# Altium schematic sheet 5_Airframe-NXP_i.MX7_Power.SchDoc
size A2; SheetNumber: 5; SheetTotal: 9
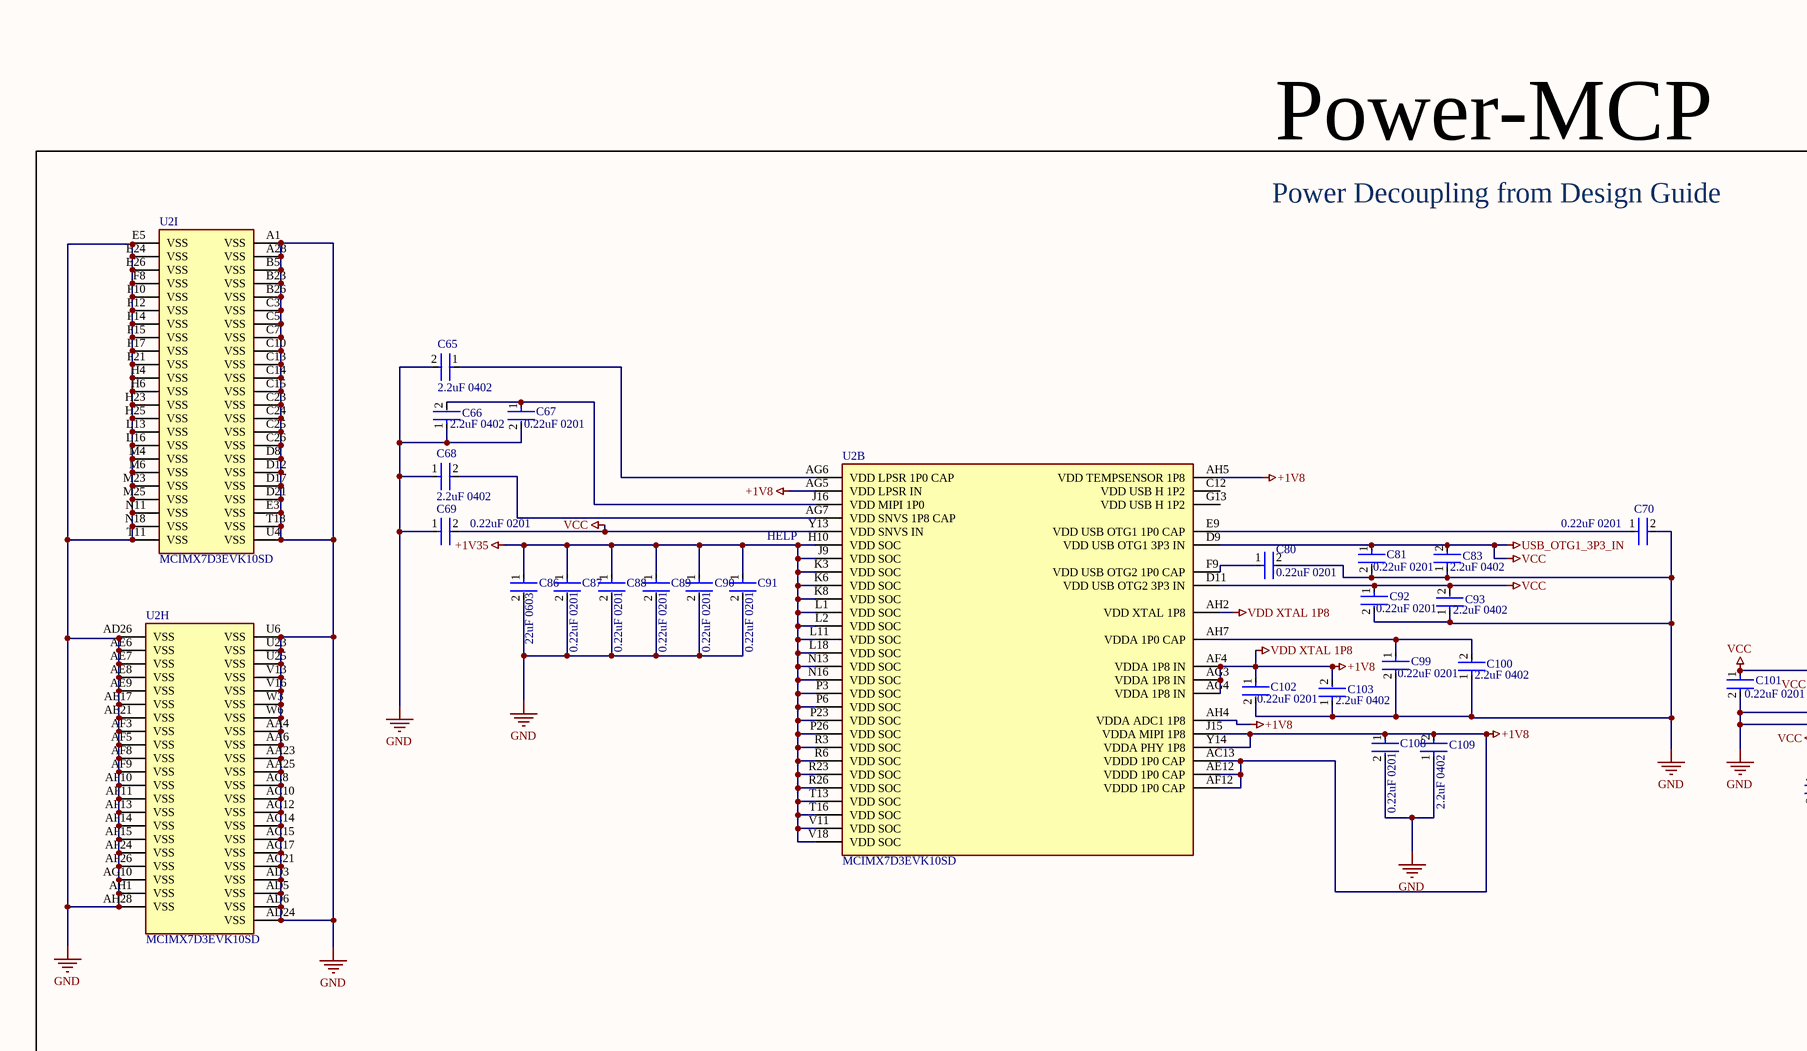
[diagram p0: 5_Airframe-NXP_i.MX7_Power.SchDoc, left]
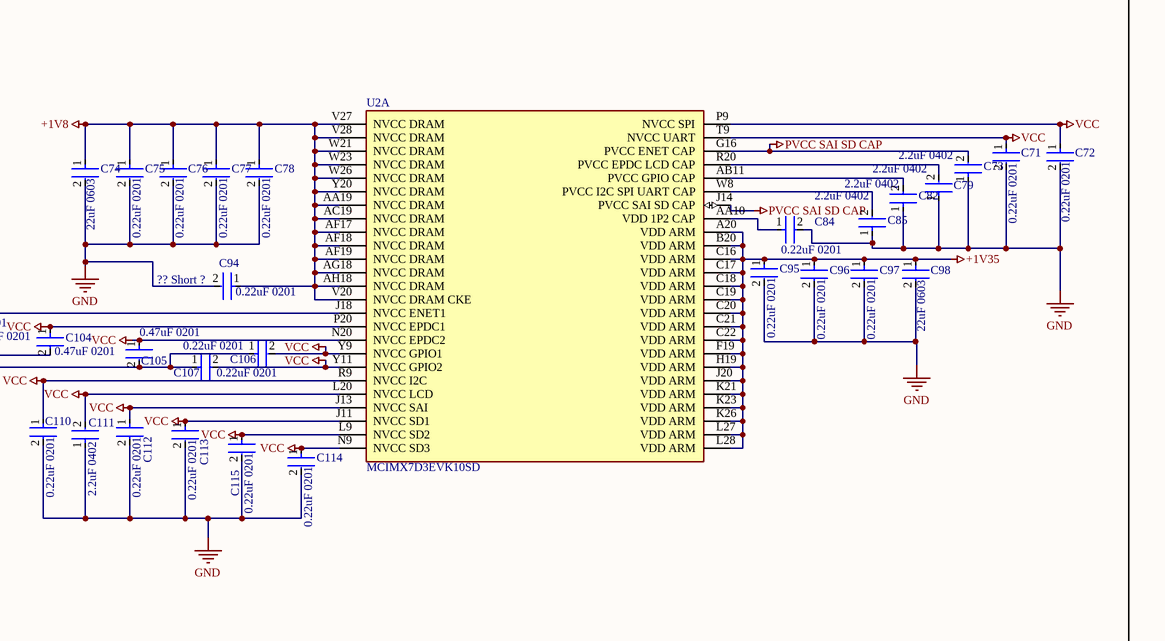
[diagram p1: 5_Airframe-NXP_i.MX7_Power.SchDoc, right]

## Parts
C65  2.2uF 0402  [FP-C0402C225M9PACTU-MFG]
C66  2.2uF 0402  [FP-C0402C225M9PACTU-MFG]
C67  0.22uF 0201  [FP-C0603-030-0_03-IPC_C]
C68  2.2uF 0402  [FP-C0402C225M9PACTU-MFG]
C69  0.22uF 0201  [FP-C0603-030-0_03-IPC_C]
C70  0.22uF 0201  [FP-C0603-030-0_03-IPC_C]
C71  0.22uF 0201  [FP-C0603-030-0_03-IPC_C]
C72  0.22uF 0201  [FP-C0603-030-0_03-IPC_C]
C73  2.2uF 0402  [FP-C0402C225M9PACTU-MFG]
C74  22uF 0603  [FP-GRM188-0_2-IPC_C]
C75  0.22uF 0201  [FP-C0603-030-0_03-IPC_C]
C76  0.22uF 0201  [FP-C0603-030-0_03-IPC_C]
C77  0.22uF 0201  [FP-C0603-030-0_03-IPC_C]
C78  0.22uF 0201  [FP-C0603-030-0_03-IPC_C]
C79  2.2uF 0402  [FP-C0402C225M9PACTU-MFG]
C80  0.22uF 0201  [FP-C0603-030-0_03-IPC_C]
C81  0.22uF 0201  [FP-C0603-030-0_03-IPC_C]
C82  2.2uF 0402  [FP-C0402C225M9PACTU-MFG]
C83  2.2uF 0402  [FP-C0402C225M9PACTU-MFG]
C84  0.22uF 0201  [FP-C0603-030-0_03-IPC_C]
C85  2.2uF 0402  [FP-C0402C225M9PACTU-MFG]
C86  22uF 0603  [FP-GRM188-0_2-IPC_C]
C87  0.22uF 0201  [FP-C0603-030-0_03-IPC_C]
C88  0.22uF 0201  [FP-C0603-030-0_03-IPC_C]
C89  0.22uF 0201  [FP-C0603-030-0_03-IPC_C]
C90  0.22uF 0201  [FP-C0603-030-0_03-IPC_C]
C91  0.22uF 0201  [FP-C0603-030-0_03-IPC_C]
C92  0.22uF 0201  [FP-C0603-030-0_03-IPC_C]
C93  2.2uF 0402  [FP-C0402C225M9PACTU-MFG]
C94  0.22uF 0201  [FP-C0603-030-0_03-IPC_C]
C95  0.22uF 0201  [FP-C0603-030-0_03-IPC_C]
C96  0.22uF 0201  [FP-C0603-030-0_03-IPC_C]
C97  0.22uF 0201  [FP-C0603-030-0_03-IPC_C]
C98  22uF 0603  [FP-GRM188-0_2-IPC_C]
C99  0.22uF 0201  [FP-C0603-030-0_03-IPC_C]
C100  2.2uF 0402  [FP-C0402C225M9PACTU-MFG]
C101  0.22uF 0201  [FP-C0603-030-0_03-IPC_C]
C102  0.22uF 0201  [FP-C0603-030-0_03-IPC_C]
C103  2.2uF 0402  [FP-C0402C225M9PACTU-MFG]
C104  0.47uF 0201  [FP-C0603-030-0_03-IPC_C]
C105  0.47uF 0201  [FP-C0603-030-0_03-IPC_C]
C106  0.22uF 0201  [FP-C0603-030-0_03-IPC_C]
C107  0.22uF 0201  [FP-C0603-030-0_03-IPC_C]
C108  0.22uF 0201  [FP-C0603-030-0_03-IPC_C]
C109  2.2uF 0402  [FP-C0402C225M9PACTU-MFG]
C110  0.22uF 0201  [FP-C0603-030-0_03-IPC_C]
C111  2.2uF 0402  [FP-C0402C225M9PACTU-MFG]
C112  0.22uF 0201  [FP-C0603-030-0_03-IPC_C]
C113  0.22uF 0201  [FP-C0603-030-0_03-IPC_C]
C114  0.22uF 0201  [FP-C0603-030-0_03-IPC_C]
C115  0.22uF 0201  [FP-C0603-030-0_03-IPC_C]
U2  MCIMX7D3EVK10SD  [FP-SOT1839-1-IPC_C]  (parts A,B,H,I of 9)

## Nets
+1V8: C74.1 C75.1 C76.1 C77.1 C78.1 C94.1 C102.1 C103.2 C108.1 C109.2 U2.AA19(NVCC_DRAM) U2.AC13(VDDD_1P0_CAP) U2.AC19(NVCC_DRAM) U2.AE12(VDDD_1P0_CAP) U2.AF4(VDDA_1P8_IN) U2.AF12(VDDD_1P0_CAP) U2.AF17(NVCC_DRAM) U2.AF18(NVCC_DRAM) U2.AF19(NVCC_DRAM) U2.AG3(VDDA_1P8_IN) U2.AG4(VDDA_1P8_IN) U2.AG5(VDD_LPSR_IN) U2.AG18(NVCC_DRAM) U2.AH2(VDD_XTAL_1P8) U2.AH4(VDDA_ADC1_1P8) U2.AH5(VDD_TEMPSENSOR_1P8) U2.AH18(NVCC_DRAM) U2.J15(VDDA_MIPI_1P8) U2.V20(NVCC_DRAM_CKE) U2.V27(NVCC_DRAM) U2.V28(NVCC_DRAM) U2.W21(NVCC_DRAM) U2.W23(NVCC_DRAM) U2.W26(NVCC_DRAM) U2.Y14(VDDA_PHY_1P8) U2.Y20(NVCC_DRAM)  [also labelled VDD XTAL 1P8]
+1V35: C86.1 C87.1 C88.1 C89.1 C90.1 C91.1 C95.1 C96.1 C97.1 C98.1 U2.A20(VDD_ARM) U2.B20(VDD_ARM) U2.C16(VDD_ARM) U2.C17(VDD_ARM) U2.C18(VDD_ARM) U2.C19(VDD_ARM) U2.C20(VDD_ARM) U2.C21(VDD_ARM) U2.C22(VDD_ARM) U2.F19(VDD_ARM) U2.H10(VDD_SOC) U2.H19(VDD_ARM) U2.J9(VDD_SOC) U2.J20(VDD_ARM) U2.K3(VDD_SOC) U2.K6(VDD_SOC) U2.K8(VDD_SOC) U2.K21(VDD_ARM) U2.K23(VDD_ARM) U2.K26(VDD_ARM) U2.L1(VDD_SOC) U2.L2(VDD_SOC) U2.L11(VDD_SOC) U2.L18(VDD_SOC) U2.L27(VDD_ARM) U2.L28(VDD_ARM) U2.N13(VDD_SOC) U2.N16(VDD_SOC) U2.P3(VDD_SOC) U2.P6(VDD_SOC) U2.P23(VDD_SOC) U2.P26(VDD_SOC) U2.R3(VDD_SOC) U2.R6(VDD_SOC) U2.R23(VDD_SOC) U2.R26(VDD_SOC) U2.T13(VDD_SOC) U2.T16(VDD_SOC) U2.V11(VDD_SOC) U2.V18(VDD_SOC)
GND: C65.2 C66.1 C67.2 C68.1 C69.1 C70.2 C71.2 C72.2 C73.1 C74.2 C75.2 C76.2 C77.2 C78.2 C79.1 C80.2 C81.2 C82.1 C83.1 C84.2 C85.1 C86.2 C87.2 C88.2 C89.2 C90.2 C91.2 C92.2 C93.1 C94.2 C95.2 C96.2 C97.2 C98.2 C99.2 C100.1 C101.2 C102.2 C103.1 C104.2 C105.2 C106.1 C107.1 C108.2 C109.1 C110.2 C111.1 C112.2 C113.2 C114.2 C115.2 U2.A1(VSS) U2.A28(VSS) U2.AA4(VSS) U2.AA6(VSS) U2.AA23(VSS) U2.AA25(VSS) U2.AC8(VSS) U2.AC10(VSS) U2.AC12(VSS) U2.AC14(VSS) U2.AC15(VSS) U2.AC17(VSS) U2.AC21(VSS) U2.AD3(VSS) U2.AD5(VSS) U2.AD6(VSS) U2.AD24(VSS) U2.AD26(VSS) U2.AE6(VSS) U2.AE7(VSS) U2.AE8(VSS) U2.AE9(VSS) U2.AE17(VSS) U2.AE21(VSS) U2.AF3(VSS) U2.AF5(VSS) U2.AF8(VSS) U2.AF9(VSS) U2.AF10(VSS) U2.AF11(VSS) U2.AF13(VSS) U2.AF14(VSS) U2.AF15(VSS) U2.AF24(VSS) U2.AF26(VSS) U2.AG10(VSS) U2.AH1(VSS) U2.AH28(VSS) U2.B5(VSS) U2.B23(VSS) U2.B26(VSS) U2.C3(VSS) U2.C5(VSS) U2.C7(VSS) U2.C10(VSS) U2.C13(VSS) U2.C14(VSS) U2.C15(VSS) U2.C23(VSS) U2.C24(VSS) U2.C25(VSS) U2.C26(VSS) U2.D8(VSS) U2.D12(VSS) U2.D17(VSS) U2.D21(VSS) U2.E3(VSS) U2.E5(VSS) U2.E24(VSS) U2.E26(VSS) U2.F8(VSS) U2.F10(VSS) U2.F12(VSS) U2.F14(VSS) U2.F15(VSS) U2.F17(VSS) U2.F21(VSS) U2.H4(VSS) U2.H6(VSS) U2.H23(VSS) U2.H25(VSS) U2.L13(VSS) U2.L16(VSS) U2.M4(VSS) U2.M6(VSS) U2.M23(VSS) U2.M25(VSS) U2.N11(VSS) U2.N18(VSS) U2.T11(VSS) U2.T18(VSS) U2.U4(VSS) U2.U6(VSS) U2.U23(VSS) U2.U25(VSS) U2.V13(VSS) U2.V16(VSS) U2.W3(VSS) U2.W6(VSS)
PVCC SAI SD CAP: C73.2 U2.G16(PVCC_ENET_CAP) U2.J14(PVCC_SAI_SD_CAP)
USB_OTG1_3P3_IN: C69.2 C71.1 C72.1 C81.1 C83.2 C92.1 C93.2 C101.1 C104.1 C105.1 C106.2 C107.2 C110.1 C111.2 C112.1 C113.1 C114.1 C115.1 U2.D9(VDD_USB_OTG1_3P3_IN) U2.D11(VDD_USB_OTG2_3P3_IN) U2.J11(NVCC_SD1) U2.J13(NVCC_SAI) U2.J18(NVCC_ENET1) U2.L9(NVCC_SD2) U2.L20(NVCC_LCD) U2.N9(NVCC_SD3) U2.N20(NVCC_EPDC2) U2.P9(NVCC_SPI) U2.P20(NVCC_EPDC1) U2.R9(NVCC_I2C) U2.T9(NVCC_UART) U2.Y9(NVCC_GPIO1) U2.Y11(NVCC_GPIO2) U2.Y13(VDD_SNVS_IN)  [also labelled VCC]
NetC65_1: C65.1 U2.AG6(VDD_LPSR_1P0_CAP)
NetC66_2: C66.2 C67.1 U2.J16(VDD_MIPI_1P0)
NetC68_2: C68.2 U2.AG7(VDD_SNVS_1P8_CAP)
NetC70_1: C70.1 U2.E9(VDD_USB_OTG1_1P0_CAP)
NetC79_2: C79.2 U2.R20(PVCC_EPDC_LCD_CAP)
NetC80_1: C80.1 U2.F9(VDD_USB_OTG2_1P0_CAP)
NetC82_2: C82.2 U2.AB11(PVCC_GPIO_CAP)
NetC84_1: C84.1 U2.AA10(VDD_1P2_CAP)
NetC85_2: C85.2 U2.W8(PVCC_I2C_SPI_UART_CAP)
NetC99_1: C99.1 C100.2 U2.AH7(VDDA_1P0_CAP)

Not connected (* = marked no-connect by the designer): U2 C12(VDD_USB_H_1P2) G13(VDD_USB_H_1P2)

## Notes on the sheet
- Power-MCP
- Power Decoupling from Design Guide
- HELP
- (near C94) ?? Short ?

## Library data of the parts
C65 C66 C68 C73 C79 C82 C83 C85 C93 C100 C103 C109 C111 = CMP-2008-02064-3: CAP CER 2.2UF 6.3V X5R 0402; Tolerance: 20%; Dissipation Factor: 5%; Dielectric Material: Ceramic; Lead Free: Lead Free; Depth: 0.5mm; Series: C; Termination: SMD/SMT; Case Code (Metric): 1005; Case/Package: 0402; Dielectric: X5R; RoHS Compliant: Yes; Thickness: 0.022inch; Voltage Rating: 6.3V; Voltage: 6.3V; Height: 0.5mm; Mount: Surface Mount; Construction: Flat; Case Code (Imperial): 0402; Min Operating Temperature: -55°C; Contact Plating: Tin; Radiation Hardening: No; Number of Pins: 2; Voltage Rating (DC): 6.3V; Capacitance: 2.2uF; Width: 0.5mm; Package Quantity: 1; Packaging: Tape and Reel; Max Operating Temperature: 85°C; Length: 1mm; REACH SVHC: No SVHC
C67 C69-C72 C75-C78 C80 C81 C84 C87-C92 C94-C97 C99 C101 C102 C104-C108 C110 C112-C115 = CMP-08246-007095-1: Multilayer Ceramic Capacitors 220nF ±10% 6.3V X6S SMD 0201; Dielectric: X6S; Resistor Type: Ceramic; Length: 0.6mm; Capacitance: 220nF; Case Code (Metric): 0603; Series: C; Width: 0.012inch; Height: 0.3mm; Voltage Rating: 6.3V; Max Operating Temperature: 105°C; REACH SVHC: No SVHC; RoHS Compliant: Yes; Tolerance: 10%; Termination: SMD/SMT; Case/Package: 0201; Case Code (Imperial): 0201; Weight: 6E-06oz; Lead Free: Lead Free; Construction: Flat; Thickness: 300um; Mount: Surface Mount; Dielectric Material: Ceramic; Voltage Rating (DC): 6.3V; Packaging: Cut Tape; Package Quantity: 1; Min Operating Temperature: -55°C; Depth: 0.3mm
C74 C86 C98 = CMP-2000-06337-3: Chip Multilayer Ceramic Capacitors for General Purpose, 0603, 22uF, X5R, 15%, 20%, 10V; Tolerance: 20%; Weight: 0.000222oz; Material: Ceramic; Depth: 0.8mm; Length: 1.6mm; Termination: SMD/SMT; Capacitance: 22uF; Packaging: Tape and Reel; Width: 0.8mm; Voltage Rating: 10V; Case Code (Imperial): 0603; Mount: Surface Mount; Voltage Rating (DC): 10V; Case/Package: 0603; Thickness: 0.039inch; REACH SVHC: No SVHC; Dielectric: X5R; Height: 0.8mm; Package Quantity: 4000; Case Code (Metric): 1608; Min Operating Temperature: -55°C; Lead Free: Lead Free; Max Operating Temperature: 85°C
U2 = CMP-10096-000008-1: I.MX 7DUAL: REV 1.3; Manufacturer: NXP; Number Of I2C Channels: 4; Number Of Timers/Counters: 11; Nominal Supply Current: 1-1000mA; Max Junction Temp: +105°C; Number Of Uart Channels: 7; Number Of Cores: 2; Interface: I2C,SPI,UART,USB,Ethernet,I2S,LVDS,PCIe,Other; Ram Size: 256KBytes; Data Bus Width: 32bits; Number Of Usb Channels: 3; Number Of Adc Channels: 1; Standoff Height: 0.13mm; Frequency: 1GHz; Max Supply Voltage: 3.6V; Core Architecture: Arm Cortex-A7; Number Of Spi Channels: 5; Memory Type: FLASH,NAND,DDR2,DDR3,OTHER; Min Supply Voltage: 0.95V; ComponentLink2URL: https://www.nxp.com/docs/en/data-sheet/IMX7DCEC.pdf; Number Of Pwm Channels: 4; Package: SOT1839-1; Temperature: -20°C to +105°C; Footprint Url: https://www.nxp.com/docs/en/package-information/98ASA00727D.pdf; RoHS: TRUE; Temperature Range Low: -20°C; Lead Free: Yes; Category: IC; Ipc Land Pattern Name: BGA784N40P28X28_1200X1200X110; Device Class L3: Microprocessors; Mouser Description: i.MX 7Dual: 2x Cortex A7, 2x USB 2.0 OTG with PHY, PCIe, 2xSDIO/MMC, 2x Ethernet, Security; ComponentLink2Description: Datasheet; Manufacturer Part Number: MCIMX7D3EVK10SD; Octopart: https://octopart.com/mcimx7d3evk10sd-nxp+semiconductors-84356608; Digikey Description: I.MX 7DUAL: REV 1.3; Device Class L1: Integrated Circuits (ICs); Temperature Range High: +105°C; Height: 1.1mm; Automotive: No; Number Of Ethernet Channels: 2; Number Of A/D Converters: 1; Device Class L2: Embedded Processors and Controllers